# Altium schematic sheet OUTPUT.SchDoc
size A; SheetNumber: 4; SheetTotal: 4
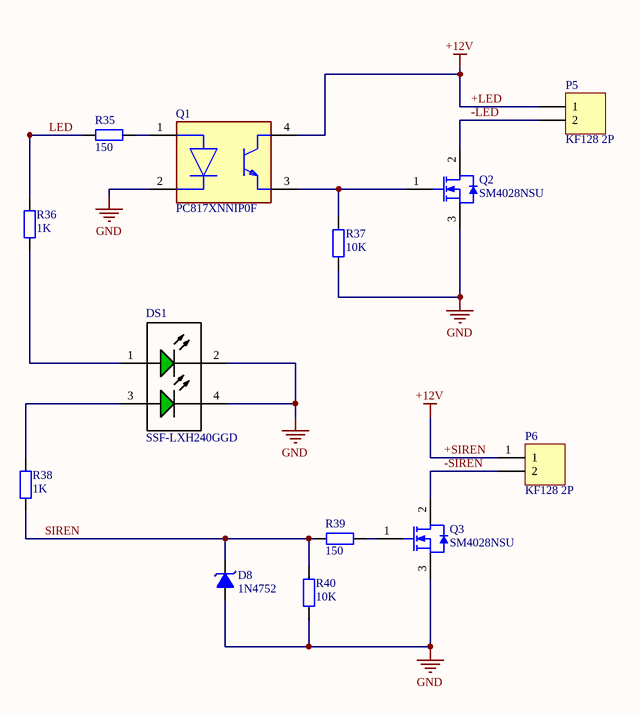
[diagram p0: OUTPUT.SchDoc]

## Parts
D8  1N4752  [DIODE ZENNER SMD SOD80]
DS1  SSF-LXH240GGD  [LUMX-SSF-LXH240GGD_V]
P5  KF128 2P  [KF128_2P]
P6  KF128 2P  [KF128_2P]
Q1  PC817XNNIP0F  [FP-PC817XNNIP0F-MFG]
Q2  SM4028NSU  [INF-PG-TO252-3-313_L]
Q3  SM4028NSU  [INF-PG-TO252-3-313_L]
R35  150  [tro smd 0805]
R36  1K  [tro smd 0805]
R37  10K  [tro smd 0805]
R38  1K  [tro smd 0805]
R39  150  [tro smd 0805]
R40  10K  [tro smd 0805]

## Nets
+LED: P5.1 P6.1 Q1.4(C)  [also labelled +12V, +SIREN]
GND: D8.1(A) DS1.2(K) DS1.4(K) Q1.2(C) Q2.3(SOURCE) Q3.3(SOURCE) R37.2 R40.2
-LED: P5.2 Q2.2(DRAIN)
-SIREN: P6.2 Q3.2(DRAIN)
LED: R35.2 R36.2
SIREN: D8.2(K) R38.1 R39.2 R40.1
NetDS1_1: DS1.1(A) R36.1
NetDS1_3: DS1.3(A) R38.2
NetQ1_1: Q1.1(A) R35.1
NetQ1_3: Q1.3(E) Q2.1(GATE) R37.1
NetQ3_1: Q3.1(GATE) R39.1

## Library data of the parts
D8 = Diode Zener 15V: Dán; Don_Vi: Con; Ma_Hang: MH002883; Ten_Linh_Kien: Diode Zener 1/2W 15V SMD1206 ZMM15; Ghi_Chu: *; Chung_Loai: Dán; Kieu_Chan: *; ComponentLink1Description: New link; ComponentLink1URL: https://www.thegioiic.com/zmm24-diode-zener-24v-500mw-smd
DS1 = CMP-2000-07152-1: LED, Green, 105 mW, 2.2 V, -40 to 85 degC, 4-Pin THD, RoHD, Bulk; Manufacturer: Lumex; Pin_Count: 4; Number of LEDs: 2; Intensity: 30mcd; Lens Appearance: ColoredDiffused; LED Material: GaP; Type: Bi-LevelUni-Color; Reverse Voltage: 5(Min)V; Viewing Angle: 60; Peak Wavelength: 565nm; Dimension: 12.58x10.77x9.65mm; Color: Green; Operating Temperature: N/A; Mounting Technology: ThroughHole; Datasheet Version: Rev. H, 03/2001; Manufacturer URL: http://www.lumexinstruments.com/; Part No: SSF-LXH240GGD; Supplier_Package: N/A; Packaging: N/A; Family: SSF-LXH240GGD; ECCN: EAR99; Mounting: ThroughHole; Lens Dimensions: 2.9x2.9x2.64mm; HTS: 8541402000; Dominant Wavelength: N/A; Package Reference: SSF-LXH240GGD; RoHS: Unknown; Supplier: Lumex; Datasheet URL: http://www.lumex.com/content/files/ProductAttachment/SSF-LXH240GGD.pdf; Package Description: 4-Pin Through Hole Device, Body 10.77 x 4.32 mm, Pitch 2.54 mm
P5 P6 = KF128 2P: Header, 2-Pin, pitch 5.08mm; MPN: KF128-2P; Solder: WAVE
Q1 = CMP-65434-000005-1: OPTOISOLATOR 5KV TRANS 4SMD; Reverse Breakdown Voltage: 6V; Output Current per Channel: 30mA; Power Dissipation: 200mW; Collector-emitter Voltage-Max: 200mV; Max Output Voltage: 80V; Input Current: 50mA; Forward Voltage: 1.4V; Fall Time: 18000ns; Number of Elements: 1; Input Type: DC; Packaging: Tape and Reel; RoHS Compliant: Yes; Contact Plating: Copper; Min Operating Temperature: -30°C; Collector Emitter Saturation Voltage: 200mV; Max Input Current: 50mA; Radiation Hardening: No; Max Collector Current: 50mA; Case/Package: SMD/SMT; Mount: Surface Mount; Output Voltage: 80V; Forward Current: 50mA; Max Power Dissipation: 200mW; Collector Emitter Voltage (VCEO): 80V; Number of Channels: 1; Rise Time: 18000ns; Isolation Voltage: 5kV; Number of Pins: 4; Lead Free: Lead Free; Package Quantity: 2000; Isolation Voltage-Max: 5kV; Max Operating Temperature: 100°C; ComponentLink1Description: New link; ComponentLink1URL: https://www.thegioiic.com/pc817x2nip0f-optoisolator-transistor-output-5000vrms-1-channel-4-smd
Q2 Q3 = CMP-1164-00349-1: N-Channel CoolMOS E6 Power-Transistor, 600 V VDS, 7.3 A ID, -55 to 150 degC, PG-TO252-3-313, Reel, Green; Manufacturer: Infineon; PartNumber: IPD60R600C6; IDpuls (max): 19Â A; VDS (max): 600Â V; VGS(th) (min): 2.5Â V; Ptot (max): 63Â W; Rth: 2Â K/W; VGS(th) (max): 3.5Â V; QG: 20.5Â nC; Green: TRUE; RDS (on) (max): 600Â mOhm; ID (max): 7.3Â A; RthJA (max): 62Â K/W; Polarity: N; Packing: Reel; PackageVersion: Oct-10; ComponentLink3Description: Package Specification; ComponentLink3URL: http://www.infineon.com/dgdl/PG-TO252-3-313-Package_Overview.pdf?folderId=db3a30432b57a660012b81890ade72d2&fileId=db3a30432b57a660012b8193af2872eb; Mounting Technology: Surface Mount; Technology: CoolMOS C6; PackageDescription: 3-Pin Plastic (Green) Transistor Single Outline Package, 6.5 x 6.12 mm Body, 2.28 mm Pitch; ComponentLink2Description: Datasheet; RthJC (max): 2Â K/W; ComponentLink1Description: Manufacturer URL; ComponentLink1URL: http://www.infineon.com/; ComponentLink2URL: http://www.infineon.com/dgdl/IPD60R600C6_2_0.pdf?folderId=db3a30431ff98815012019af55de3f2c&fileId=db3a30432239cccd0122a83152b97d6f; PackageReference: PG-TO252-3-313; DatasheetVersion: Rev. 2.0
R35-R40 = Tro 0603 5% 10k: Dán; Don_Vi: Con; So_Chan: 2; Ten_Linh_Kien: Trở 0603 5% 10k; Ma_Hang: MH006316; Chung_Loai: Dán; Kieu_Chan: *; ComponentLink1Description: New link; ComponentLink1URL: https://www.thegioiic.com/dien-tro-1-kohm-0603-1; ComponentLink2Description: New link; ComponentLink2URL: 2300